# EAGLE design en76-vcf1-cvq (EAGLE 6.6.0)
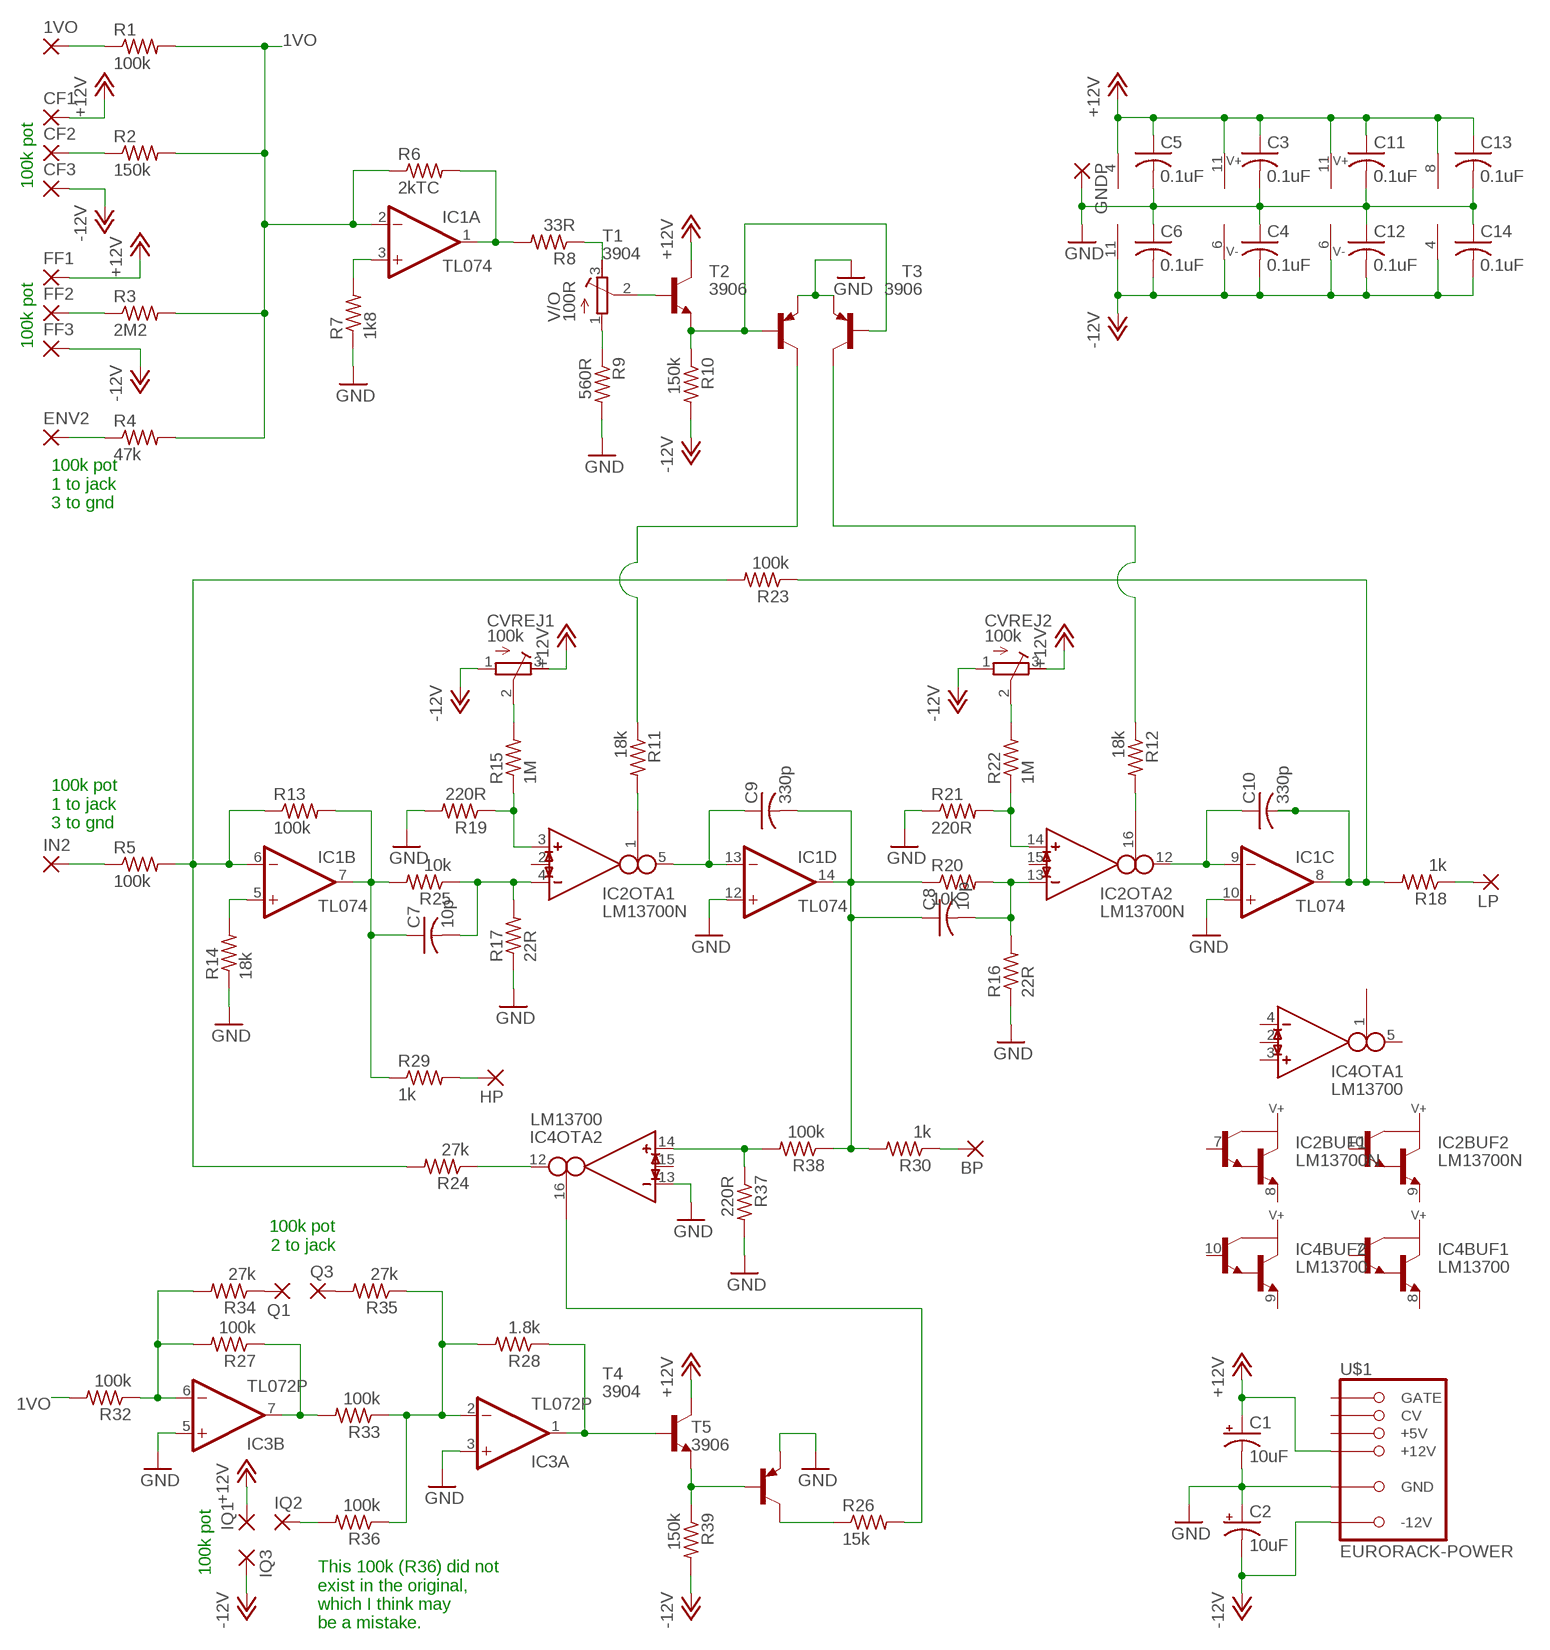
[diagram p0: schematic, sheet 1]

## Parts
1VO  2,54/1,0  [2,54/1,0]
BP  2,54/1,0  [2,54/1,0]
C1  10uF  CPOL-USE2.5-5  [E2,5-5]
C2  10uF  CPOL-USE2.5-5  [E2,5-5]
C3  0.1uF  C-US050-025X075  [C050-025X075]
C4  0.1uF  C-US050-025X075  [C050-025X075]
C5  0.1uF  C-US050-025X075  [C050-025X075]
C6  0.1uF  C-US050-025X075  [C050-025X075]
C7  10p  C-US050-025X075  [C050-025X075]
C8  10p  C-US050-025X075  [C050-025X075]
C9  330p  C-US050-025X075  [C050-025X075]
C10  330p  C-US050-025X075  [C050-025X075]
C11  0.1uF  C-US050-025X075  [C050-025X075]
C12  0.1uF  C-US050-025X075  [C050-025X075]
C13  0.1uF  C-US050-025X075  [C050-025X075]
C14  0.1uF  C-US050-025X075  [C050-025X075]
CF1  2,54/1,0  [2,54/1,0]
CF2  2,54/1,0  [2,54/1,0]
CF3  2,54/1,0  [2,54/1,0]
CVREJ1  100k  R-TRIMM64W  [RTRIM64W]
CVREJ2  100k  R-TRIMM64W  [RTRIM64W]
ENV2  2,54/1,0  [2,54/1,0]
FF1  2,54/1,0  [2,54/1,0]
FF2  2,54/1,0  [2,54/1,0]
FF3  2,54/1,0  [2,54/1,0]
GNDP  2,54/1,0  [2,54/1,0]
HP  2,54/1,0  [2,54/1,0]
IC1  TL074  TL074-TOPP  [DIL14]
IC2  LM13700N  [DIL16]
IC3  TL072P  [DIL08]
IC4  LM13700  LM13700-TOPDIP16  [DIL16]
IN2  2,54/1,0  [2,54/1,0]
IQ1  2,54/1,0  [2,54/1,0]
IQ2  2,54/1,0  [2,54/1,0]
IQ3  2,54/1,0  [2,54/1,0]
LP  2,54/1,0  [2,54/1,0]
Q1  2,54/1,0  [2,54/1,0]
Q3  2,54/1,0  [2,54/1,0]
R1  100k  R-US_0207/10  [0207/10]
R2  150k  R-US_0207/10  [0207/10]
R3  2M2  R-US_0207/10  [0207/10]
R4  47k  R-US_0207/10  [0207/10]
R5  100k  R-US_0207/10  [0207/10]
R6  2kTC  R-US_0207/10  [0207/10]
R7  1k8  R-US_0207/10  [0207/10]
R8  33R  R-US_0207/10  [0207/10]
R9  560R  R-US_0207/10  [0207/10]
R10  150k  R-US_0207/10  [0207/10]
R11  18k  R-US_0207/10  [0207/10]
R12  18k  R-US_0207/10  [0207/10]
R13  100k  R-US_0207/10  [0207/10]
R14  18k  R-US_0207/10  [0207/10]
R15  1M  R-US_0207/10  [0207/10]
R16  22R  R-US_0207/10  [0207/10]
R17  22R  R-US_0207/10  [0207/10]
R18  1k  R-US_0207/10  [0207/10]
R19  220R  R-US_0207/10  [0207/10]
R20  10k  R-US_0207/10  [0207/10]
R21  220R  R-US_0207/10  [0207/10]
R22  1M  R-US_0207/10  [0207/10]
R23  100k  R-US_0207/10  [0207/10]
R24  27k  R-US_0207/10  [0207/10]
R25  10k  R-US_0207/10  [0207/10]
R26  15k  R-US_0207/10  [0207/10]
R27  100k  R-US_0207/10  [0207/10]
R28  1.8k  R-US_0207/10  [0207/10]
R29  1k  R-US_0207/10  [0207/10]
R30  1k  R-US_0207/10  [0207/10]
R32  100k  R-US_0207/10  [0207/10]
R33  100k  R-US_0207/10  [0207/10]
R34  27k  R-US_0207/10  [0207/10]
R35  27k  R-US_0207/10  [0207/10]
R36  100k  R-US_0207/10  [0207/10]
R37  220R  R-US_0207/10  [0207/10]
R38  100k  R-US_0207/10  [0207/10]
R39  150k  R-US_0207/10  [0207/10]
T1  3904  -NPN-TO92-EBC  [TO92-EBC]
T2  3906  -PNP-TO92-EBC  [TO92-EBC]
T3  3906  -PNP-TO92-EBC  [TO92-EBC]
T4  3904  -NPN-TO92-EBC  [TO92-EBC]
T5  3906  -PNP-TO92-EBC  [TO92-EBC]
U$1  EURORACK-POWER  [PINSHRD_PTH_2X8]
V/O  100R  R-TRIMM64W  [RTRIM64W]

## Nets
1VO: IC1.2(A:-IN) R1.2 R2.2 R3.2 R4.2 R6.1 R32.2
+12V: C1.+ C3.1 C5.1 C11.1 C13.1 CF1.1(P) CVREJ1.3(E) CVREJ2.3(E) FF1.1(P) IC1.4(P:V+) IC2.11 IC3.8(P:V+) IC4.11 IQ1.1(P) T1.C T4.C U$1.+12V@1(+12V) U$1.+12V@2(+12V)
-12V: C2.- C4.2 C6.2 C12.2 C14.2 CF3.1(P) CVREJ1.1(A) CVREJ2.1(A) FF3.1(P) IC1.11(P:V-) IC2.6 IC3.4(P:V-) IC4.6 IQ3.1(P) R10.2 R39.2 U$1.-12V@1(-12V) U$1.-12V@2(-12V)
GND: C1.- C2.+ C3.2 C4.1 C5.2 C6.1 C11.2 C12.1 C13.2 C14.1 GNDP.1(P) IC1.10(C:+IN) IC1.12(D:+IN) IC3.3(A:+IN) IC3.5(B:+IN) IC4.13(OTA2:IN_N) R7.1 R9.2 R14.1 R16.1 R17.1 R19.2 R21.1 R37.2 T2.E T3.E T5.E U$1.GND@1(GND) U$1.GND@2(GND) U$1.GND@3(GND) U$1.GND@4(GND) U$1.GND@5(GND) U$1.GND@6(GND)
N$1: 1VO.1(P) R1.1
N$2: CF2.1(P) R2.1
N$3: FF2.1(P) R3.1
N$4: ENV2.1(P) R4.1
N$5: IN2.1(P) R5.1
N$6: IC1.6(B:-IN) R5.2 R13.1 R23.2 R24.2
N$7: C7.1 IC1.7(B:OUT) R13.2 R25.2 R29.1
N$8: IC1.5(B:+IN) R14.2
N$9: C9.1 IC1.13(D:-IN) IC2.5(OTA1:OUT)
N$10: C8.1 C9.2 IC1.14(D:OUT) R20.1 R30.2 R38.1
N$11: C10.1 IC1.9(C:-IN) IC2.12(OTA2:OUT)
N$12: C10.2 IC1.8(C:OUT) R18.2 R23.1
N$13: IC2.14(OTA2:IN_P) R21.2 R22.1
N$14: CVREJ2.2(S) R22.2
N$15: C8.2 IC2.13(OTA2:IN_N) R16.2 R20.2
N$16: IC3.7(B:OUT) R27.1 R33.2
N$17: IC1.1(A:OUT) R6.2 R8.2
N$18: IC1.3(A:+IN) R7.2
N$19: C7.2 IC2.4(OTA1:IN_N) R17.2 R25.1
N$20: R9.1 V/O.1(A)
N$21: R8.1 V/O.3(E)
N$22: T1.B V/O.2(S)
N$23: R10.1 T1.E T2.B T3.B
N$24: IC2.3(OTA1:IN_P) R15.1 R19.1
N$25: CVREJ1.2(S) R15.2
N$26: IC2.1(OTA1:I_BIAS) R11.2
N$27: HP.1(P) R29.2
N$28: IC2.16(OTA2:I_BIAS) R12.2
N$29: LP.1(P) R18.1
N$30: BP.1(P) R30.1
N$31: IQ2.1(P) R36.2
N$32: Q1.1(P) R34.1
N$33: R12.1 T3.C
N$34: R11.1 T2.C
N$35: IC4.12(OTA2:OUT) R24.1
N$36: R26.1 T5.C
N$37: R39.1 T4.E T5.B
N$38: IC3.2(A:-IN) R28.2 R33.1 R35.1 R36.1
N$39: IC3.6(B:-IN) R27.2 R32.1 R34.2
N$40: IC3.1(A:OUT) R28.1 T4.B
N$41: Q3.1(P) R35.2
N$42: IC4.14(OTA2:IN_P) R37.1 R38.2
N$43: IC4.16(OTA2:I_BIAS) R26.2
Unconnected: IC2.2(OTA1:I_DIODE) IC2.7(BUF1:B) IC2.8(BUF1:E) IC2.9(BUF2:E) IC2.10(BUF2:B) IC2.15(OTA2:I_DIODE) IC4.1(OTA1:I_BIAS) IC4.2(OTA1:I_DIODE) IC4.3(OTA1:IN_P) IC4.4(OTA1:IN_N) IC4.5(OTA1:OUT) IC4.7(BUF1:B) IC4.8(BUF1:E) IC4.9(BUF2:E) IC4.10(BUF2:B) IC4.15(OTA2:I_DIODE) U$1.+5V@1(+5V) U$1.+5V@2(+5V) U$1.CV@1(CV) U$1.CV@2(CV) U$1.GATE@1(GATE) U$1.GATE@2(GATE)

## Notes on the sheet
- 100k pot
- 100k pot
- 100k pot
  1 to jack
  3 to gnd
- 100k pot
  1 to jack
  3 to gnd
- 100k pot
  2 to jack
- 100k pot
- This 100k (R36) did not
  exist in the original,
  which I think may
  be a mistake.

## Library data of the parts
1VO BP CF1-CF3 ENV2 FF1-FF3 GNDP HP IN2 IQ1-IQ3 LP Q1 Q3 = wirepad:2,54/1,0: THROUGH-HOLE PAD
C1 C2 = rcl:CPOL-US: POLARIZED CAPACITOR, American symbol
C3-C14 = rcl:C-US: CAPACITOR, American symbol
CVREJ1 CVREJ2 V/O = rcl:R-TRIMM: Trimm resistor
IC1 = mmoretti:TL074-TOP: OP AMP
IC2 = mmoretti:LM13700: Dual OTA with buffers
IC3 = mmoretti:TL072: OP AMP
IC4 = mmoretti:LM13700-TOP
R1-R30 R32-R39 = rcl:R-US_: RESISTOR, American symbol
T1 T4 = transistor-neu-to92:*-NPN-: NPN Transistror
T2 T3 T5 = transistor-neu-to92:*-PNP-: PNP Transistror
U$1 = mmoretti:EURORACK-POWER

## Board
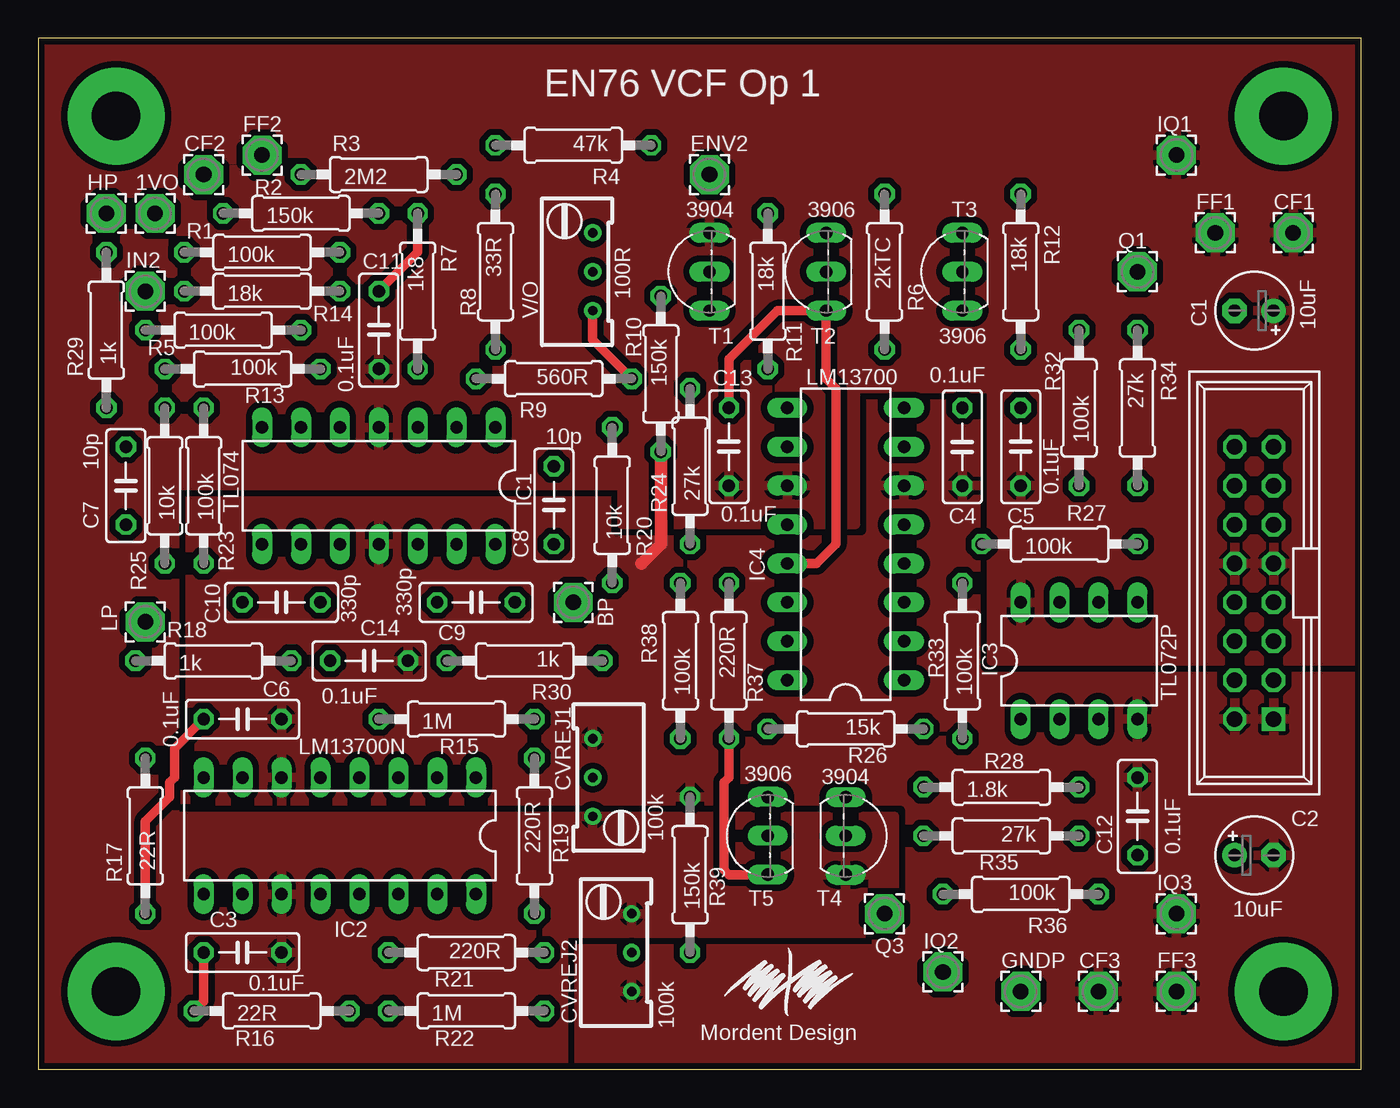
[diagram p1: board, top side]
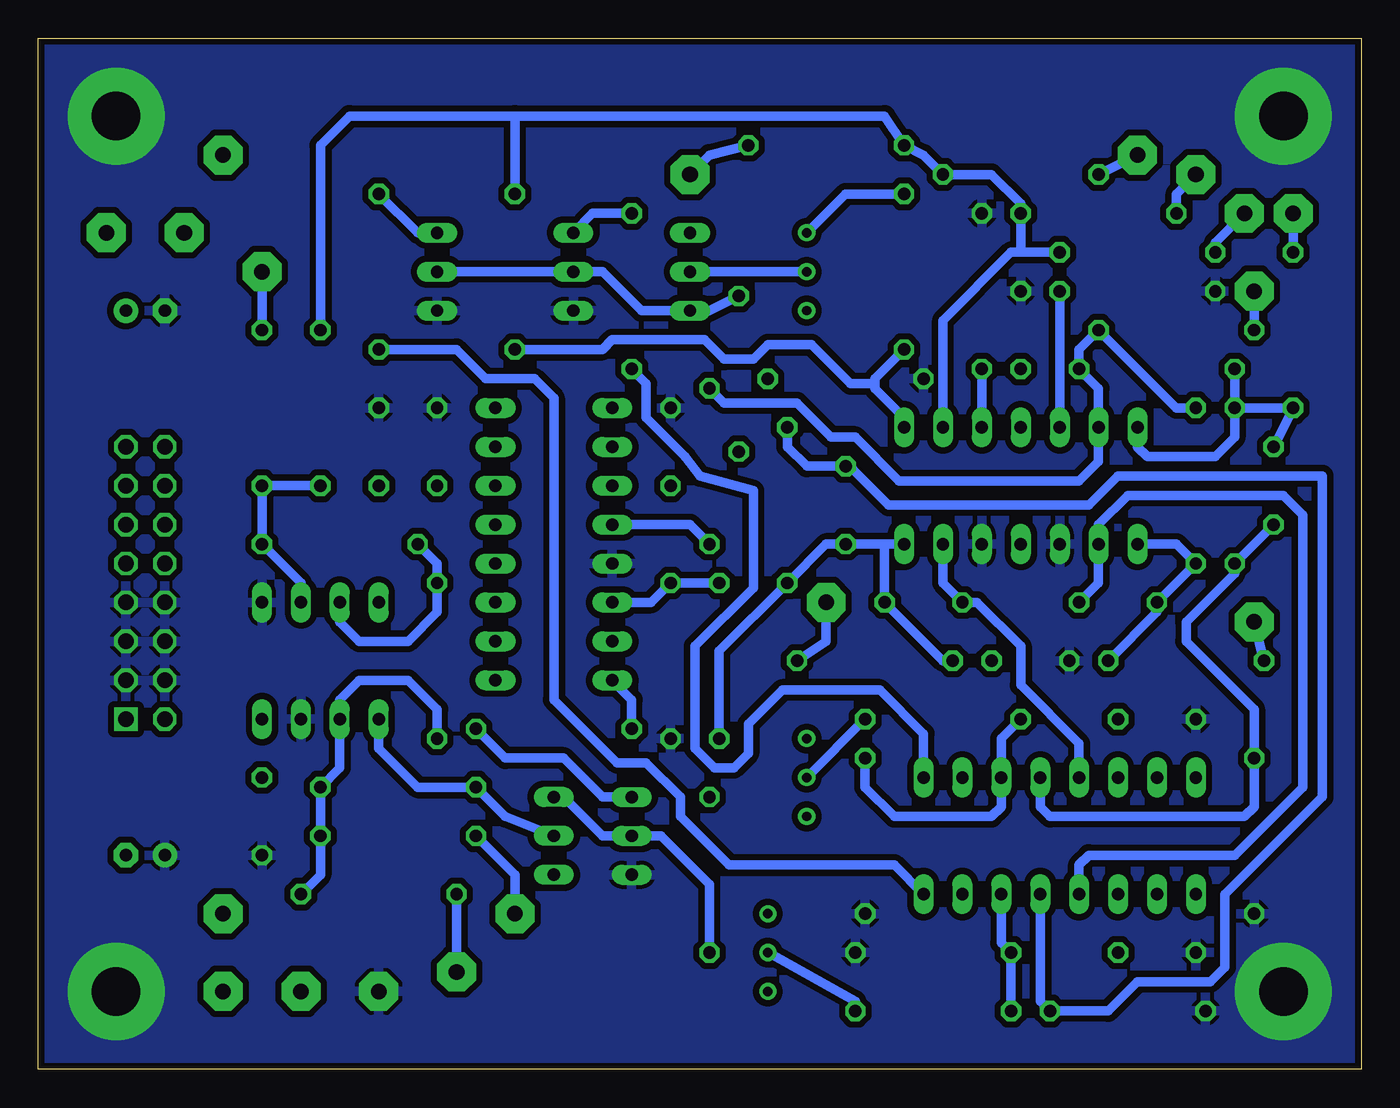
[diagram p2: board, bottom side, seen from below]

Size 86.36 x 67.31 mm. Coordinates in mm from the lower left corner, seen from the top.
Outline: 0,0 86.36,0 86.36,67.31 0,67.31 0,0
Copper layers (1*16): Top 0.035mm / dielectric 1.5mm / Bottom 0.035mm
Design rules "SeeedStudio_2layer_DRU_no_angle_20140221": minimum track width 6mil, minimum drill 12mil, track to track 6mil, track to pad 6mil, pad to pad 6mil, via to via 6mil, smd to smd 0mil, copper to edge 10mil, drill to drill 10mil, minimum pad ring 10mil, minimum via ring 6mil, stop-mask expansion 2mil, vias tented up to drill 100mil, thermal gap 10mil

### Footprints (pad centres in the part's own frame; a part is rotated, then mirrored left to right if it is on the bottom)
2,54/1,0 = drill 1.016 pad 2.54 octagon: 1 0,0
E2,5-5 = drill 0.813 pad 1.6: + -1.27,0 | drill 0.813 pad 1.6 octagon: - 1.27,0
C050-025X075 = drill 0.813 octagon: 1 -2.54,0; 2 2.54,0
RTRIM64W = drill 0.61: 1 1.27,-2.54; 2 1.27,0; 3 1.27,2.54
DIL14 = drill 0.813 long: 1 -7.62,-3.81; 2 -5.08,-3.81; 3 -2.54,-3.81; 4 0,-3.81; 5 2.54,-3.81; 6 5.08,-3.81; 7 7.62,-3.81; 8 7.62,3.81; 9 5.08,3.81; 10 2.54,3.81; 11 0,3.81; 12 -2.54,3.81; 13 -5.08,3.81; 14 -7.62,3.81
DIL16 = drill 0.813 long: 1 -8.89,-3.81; 2 -6.35,-3.81; 3 -3.81,-3.81; 4 -1.27,-3.81; 5 1.27,-3.81; 6 3.81,-3.81; 7 6.35,-3.81; 8 8.89,-3.81; 9 8.89,3.81; 10 6.35,3.81; 11 3.81,3.81; 12 1.27,3.81; 13 -1.27,3.81; 14 -3.81,3.81; 15 -6.35,3.81; 16 -8.89,3.81
DIL08 = drill 0.813 long: 1 -3.81,-3.81; 2 -1.27,-3.81; 3 1.27,-3.81; 4 3.81,-3.81; 5 3.81,3.81; 6 1.27,3.81; 7 -1.27,3.81; 8 -3.81,3.81
0207/10 = drill 0.813 octagon: 1 -5.08,0; 2 5.08,0
TO92-EBC = drill 0.813 long: B 0,-1.27; C 2.54,-1.27; E -2.54,-1.27
PINSHRD_PTH_2X8 = drill 1.016 octagon: +5V@1 3.81,1.27; +5V@2 3.81,-1.27; +12V@1 1.27,1.27; +12V@2 1.27,-1.27; -12V@1 -8.89,1.27; CV@1 6.35,1.27; CV@2 6.35,-1.27; GATE@1 8.89,1.27; GATE@2 8.89,-1.27; GND@1 -6.35,1.27; GND@2 -6.35,-1.27; GND@3 -3.81,1.27; GND@4 -3.81,-1.27; GND@5 -1.27,1.27; GND@6 -1.27,-1.27 | drill 1.016 square: -12V@2 -8.89,-1.27

### Placement (x,y rotation side)
1VO  7.62,55.88 0 top
BP  34.92,30.48 0 top
C1  79.38,49.53 180 top
C2  79.38,13.97 0 top
C3  13.34,7.62 180 top
C4  60.33,40.64 270 top
C5  64.14,40.64 90 top
C6  13.34,22.86 0 top
C7  5.71,38.1 270 top
C8  33.66,36.83 90 top
C9  28.57,30.48 0 top
C10  15.88,30.48 180 top
C11  22.23,48.26 90 top
C12  71.75,16.51 90 top
C13  45.09,40.64 90 top
C14  21.59,26.67 0 top
CF1  81.92,54.61 0 top
CF2  10.79,58.42 0 top
CF3  69.22,5.08 0 top
CVREJ1  37.47,19.05 180 top
CVREJ2  37.47,7.62 0 top
ENV2  43.81,58.42 0 top
FF1  76.83,54.61 0 top
FF2  14.61,59.69 0 top
FF3  74.3,5.08 0 top
GNDP  64.14,5.08 0 top
HP  4.45,55.88 0 top
IC1  22.23,38.1 180 top
IC2  19.68,15.24 180 top
IC3  67.94,26.67 0 top
IC4  52.7,34.29 90 top
IN2  6.99,50.8 0 top
IQ1  74.3,59.69 0 top
IQ2  59.05,6.35 0 top
IQ3  74.3,10.16 0 top
LP  6.99,29.21 0 top
Q1  71.75,52.07 0 top
Q3  55.24,10.16 0 top
R1  14.61,53.34 0 top
R2  17.14,55.88 0 top
R3  22.23,58.42 0 top
R4  34.92,60.33 180 top
R5  12.06,48.26 0 top
R6  55.24,52.07 270 top
R7  24.77,50.8 270 top
R8  29.84,52.07 270 top
R9  33.66,45.09 180 top
R10  40.64,45.4 270 top
R11  47.62,50.8 270 top
R12  64.14,52.07 270 top
R13  13.34,45.72 180 top
R14  14.61,50.8 0 top
R15  27.3,22.86 0 top
R16  15.24,3.81 0 top
R17  6.99,15.24 90 top
R18  11.43,26.67 0 top
R19  32.38,15.24 270 top
R20  37.47,36.83 90 top
R21  27.94,7.62 180 top
R22  27.94,3.81 0 top
R23  10.79,38.1 90 top
R24  42.55,39.37 90 top
R25  8.26,38.1 90 top
R26  52.7,22.23 180 top
R27  66.67,34.29 0 top
R28  62.87,18.41 0 top
R29  4.45,48.26 90 top
R30  31.75,26.67 180 top
R32  67.94,43.18 90 top
R33  60.33,26.67 90 top
R34  71.75,43.18 270 top
R35  62.87,15.24 180 top
R36  64.14,11.43 180 top
R37  45.09,26.67 270 top
R38  41.91,26.67 90 top
R39  42.55,12.7 90 top
T1  42.55,52.07 90 top
T2  50.16,52.07 90 top
T3  59.05,52.07 90 top
T4  53.98,15.24 270 top
T5  46.35,15.24 90 top
U$1  79.38,31.75 90 top
V/O  34.92,52.07 0 top

### Tracks (layer width: path | path; a pad name or v marks a point on that pad's centre or on a via)
1VO
  Bottom 0.61: IC1.2 27.3,48.9 22.86,53.34 22.23,53.34 | 22.23,53.34 R1.2 | 22.23,53.34 R2.2 22.23,56.52 24.13,58.42 R3.2 28.57,59.69 R4.2 31.11,62.23 55.24,62.23 | 55.24,62.23 66.04,62.23 67.94,60.33 R32.2 | R6.1 55.24,62.23
+12V
  pour Top (isolate 0.406): 0,38.1 38.1,38.1 38.1,35.56 53.34,35.56 53.34,44.45 62.23,44.45 62.23,26.67 86.36,26.67 86.36,67.31 0,67.31
  pour Top (isolate 0.406): 0,38.1 8.89,38.1 8.89,16.51 55.88,16.51 55.88,8.89 34.29,8.89 34.29,0 0,0
-12V
  Top 0.813: R10.2 40.64,34.29 39.37,33.02
  pour Top (isolate 0.406, rank 2): 86.36,26.67 86.36,0 34.29,0 34.29,8.89 55.88,8.89 55.88,16.51 8.89,16.51 8.89,38.1 38.1,38.1 38.1,35.56 53.34,35.56 53.34,44.45 62.23,44.45 62.23,26.67
GND  (via drill 3.17 pad 6.35)
  Top 0.61: R17.1 6.99,16.19 8.57,17.78 8.57,18.73 8.89,19.05 8.89,20.95 C6.1 | C3.2 10.79,4.45 R16.1 | R37.2 45.09,19.05 44.77,18.73 44.77,13.02 45.09,12.7 T5.E | R7.1 24.77,53.34 C11.2 | C13.2 45.09,46.35 48.26,49.53 T2.E 51.44,45.09 52.07,44.45 52.07,34.29 50.8,33.02 IC4.13
  other vias: 5.08,62.23 81.28,62.23 81.28,5.08 5.08,5.08
  pour Bottom (isolate 0.406): 0,67.31 86.36,67.31 86.36,0 0,0
N$1
  Bottom 0.61: R1.1 9.53,53.98 1VO.1
N$2
  Bottom 0.61: R2.1 12.06,57.15 CF2.1
N$3
  Bottom 0.61: R3.1 FF2.1
N$4
  Bottom 0.61: R4.1 42.55,59.69 ENV2.1
N$5
  Bottom 0.61: R5.1 IN2.1
N$6
  Bottom 0.61: R23.2 12.06,43.18 R5.2 18.41,46.99 R13.1 17.14,44.45 IC1.6 17.14,39.69 18.41,38.42 30.16,38.42 33.02,41.27 34.61,41.27 36.83,43.5 41.59,43.5 R24.2
N$7
  Bottom 0.61: C7.1 R29.1 R25.2 | R25.2 R13.2 | R25.2 8.26,41.27 9.53,40.01 13.97,40.01 14.61,40.64 IC1.7
N$8
  Bottom 0.61: IC1.5 R14.2
N$9
  Bottom 0.61: IC1.13 27.3,31.75 C9.1 25.08,30.48 22.23,27.62 22.23,25.08 18.41,21.27 IC2.5
N$10
  Bottom 0.61: R30.2 27.3,26.67 C9.2 31.11,34.29 | IC1.14 31.11,34.29 | 31.11,34.29 C8.1 34.92,34.29 R20.1 41.91,27.3 R38.1
N$11
  Bottom 0.61: C10.1 17.14,31.75 IC1.9 17.14,35.56 15.24,37.47 5.08,37.47 3.81,36.2 3.81,18.41 8.26,13.97 17.78,13.97 18.41,13.34 IC2.12
N$12
  Bottom 0.61: IC1.8 12.06,34.29 R23.1 C10.2 13.34,29.84 R18.2
N$13
  Bottom 0.61: IC2.14 23.5,8.26 R21.2 R22.1
N$14
  Bottom 0.61: R22.2 33.02,4.45 CVREJ2.2
N$15
  Bottom 0.61: IC2.13 20.95,4.45 R16.2 16.51,3.81 14.61,5.71 9.84,5.71 8.89,6.67 8.89,11.43 2.54,17.78 2.54,38.73 15.88,38.73 17.78,36.83 30.86,36.83 33.15,39.12 C8.2 36.2,39.37 37.47,40.64 R20.2
N$16
  Bottom 0.61: R27.1 60.33,33.02 R33.2 60.33,29.84 62.23,27.94 65.41,27.94 66.67,29.21 IC3.7
N$17
  Bottom 0.61: IC1.1 29.84,42.55 31.75,44.45 31.75,44.77 | 31.75,44.77 31.75,45.09 R8.2 | R6.2 49.53,46.99 48.9,47.62 42.86,47.62 41.59,46.35 39.69,46.35 38.73,47.31 35.88,47.31 33.34,44.77 31.75,44.77
N$18
  Bottom 0.61: IC1.3 R7.2
N$19
  Bottom 0.61: IC2.4 20.95,17.14 20.32,16.51 7.62,16.51 6.99,17.14 R17.2 6.99,23.5 11.43,27.94 11.43,29.21 8.26,32.38 R25.1 C7.2
N$20
  Top 0.61: V/O.1 36.2,47.62 R9.1
N$21
  Bottom 0.61: R8.1 33.66,57.15 V/O.3
N$22
  Bottom 0.61: V/O.2 T1.B
N$23
  Bottom 0.61: R10.1 42.55,49.53 T1.E 46.99,49.53 49.53,52.07 T2.B T3.B
N$24
  Bottom 0.61: R15.1 23.5,21.59 IC2.3 23.5,17.14 24.13,16.51 30.48,16.51 32.38,18.41 R19.1
N$25
  Bottom 0.61: R15.2 CVREJ1.2
N$26
  Bottom 0.61: IC2.1 28.57,21.91 31.43,24.77 37.78,24.77 40.01,22.54 40.01,20.64 40.96,19.68 42.23,19.68 43.5,20.95 43.5,27.62 39.69,31.43 39.69,37.78 43.18,38.73 44.13,40.01 46.67,42.55 46.67,44.77 R11.2
N$27
  Bottom 0.61: R29.2 HP.1
N$28
  Bottom 0.61: R12.2 59.05,46.99 57.15,45.09 53.98,45.09 52.7,43.81 52.7,24.13 48.58,20 46.67,20 44.45,17.78 44.45,16.51 41.27,13.34 30.48,13.34 IC2.16
N$29
  Bottom 0.61: LP.1 R18.1
N$30
  Bottom 0.61: BP.1 34.92,27.94 R30.1
N$31
  Bottom 0.61: R36.2 IQ2.1
N$32
  Bottom 0.61: Q1.1 R34.1
N$33
  Bottom 0.61: T3.C 61.59,54.61 R12.1
N$34
  Bottom 0.61: R11.1 50.16,55.88 T2.C
N$35
  Bottom 0.61: IC4.12 43.81,35.56 R24.1
N$36
  Bottom 0.61: T5.C 49.53,17.78 52.07,20.32 55.88,20.32 R26.1
N$37
  Bottom 0.61: R39.1 42.55,12.06 45.72,15.24 T5.B 49.53,15.24 52.07,17.78 T4.E
N$38
  Bottom 0.61: R33.1 60.33,23.5 62.23,25.4 65.41,25.4 66.67,24.13 IC3.2 66.67,19.68 R28.2 R35.1 67.94,12.7 R36.1
N$39
  Bottom 0.61: R32.1 R34.2 R27.2 69.22,31.75 IC3.6
N$40
  Bottom 0.61: T4.B 55.88,16.51 R28.1 61.59,18.41 64.14,20.95 IC3.1
N$41
  Bottom 0.61: Q3.1 55.24,12.7 R35.2
N$42
  Bottom 0.61: R38.2 R37.1 46.35,30.48 IC4.14
N$43
  Bottom 0.61: R26.2 47.62,24.13 IC4.16

### Text on the board
tPlace: EN76 VCF Op 1 | Mordent Design